# Altium schematic sheet currentdriver.SchDoc
size A4
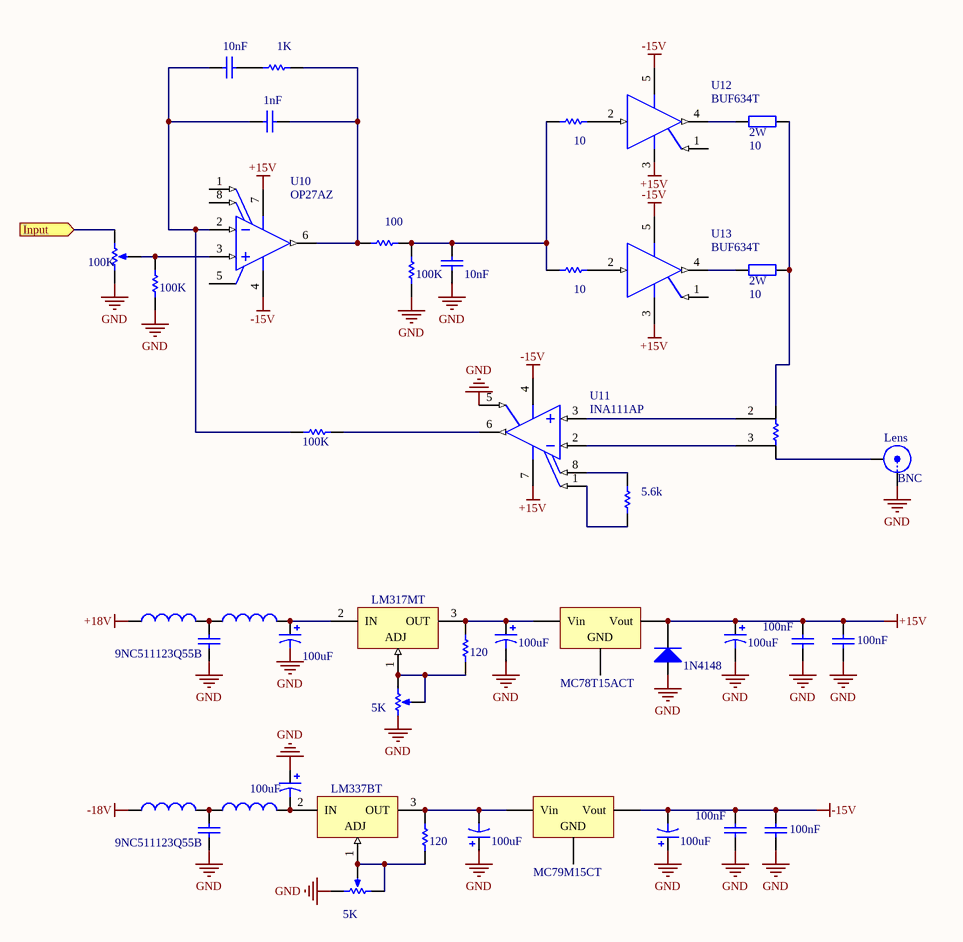
[diagram p0: currentdriver.SchDoc]

## Parts
(Parts that share a designator on the sheet are numbered #1, #2 ... from top to bottom, then left to right.)
C?#1  value 10nF  [RAD-0.3]  (hidden comment: Cap)
C?#2  value 1nF  [RAD-0.3]  (hidden comment: Cap)
C?#3  value 10nF  [RAD-0.3]  (hidden comment: Cap)
C?#4  value 100uF  [RB7.6-15]  (hidden comment: Cap Pol1)
C?#5  value 100uF  [RB7.6-15]  (hidden comment: Cap Pol1)
C?#6  value 100uF  [RB7.6-15]  (hidden comment: Cap Pol1)
C?#7  9NC511123Q55B  [RAD-0.3]
C?#8  value 100nF  [RAD-0.3]  (hidden comment: Cap)
C?#9  value 100nF  [RAD-0.3]  (hidden comment: Cap)
C?#10  value 100uF  [RB7.6-15]  (hidden comment: Cap Pol1)
C?#11  9NC511123Q55B  [RAD-0.3]
C?#12  value 100uF  [RB7.6-15]  (hidden comment: Cap Pol1)
C?#13  value 100uF  [RB7.6-15]  (hidden comment: Cap Pol1)
C?#14  value 100nF  [RAD-0.3]  (hidden comment: Cap)
C?#15  value 100nF  [RAD-0.3]  (hidden comment: Cap)
D?  1N4148  [DO-35]
L?#1  Inductor  [0402-A]  (value not drawn)
L?#2  Inductor  [0402-A]  (value not drawn)
L?#3  Inductor  [0402-A]  (value not drawn)
L?#4  Inductor  [0402-A]  (value not drawn)
Lens  BNC  [BNC_RA CON]
R?#1  value 1K  [AXIAL-0.3]  (hidden comment: Res1)
R?#2  value 10  [AXIAL-0.3]  (hidden comment: Res1)
R?#3  2W  value 10  [AXIAL-0.4]
R?#4  value 100  [AXIAL-0.3]  (hidden comment: Res1)
R?#5  value 10  [AXIAL-0.3]  (hidden comment: Res1)
R?#6  2W  value 10  [AXIAL-0.4]
R?#7  value 100K  [VR5]  (hidden comment: RPot)
R?#8  value 100K  [AXIAL-0.3]  (hidden comment: Res1)
R?#9  value 100K  [AXIAL-0.3]  (hidden comment: Res1)
R?#10  value 100K  [AXIAL-0.3]  (hidden comment: Res1)
R?#11  value 5.6k  [AXIAL-0.3]  (hidden comment: Res1)
R?#12  value 120  [AXIAL-0.3]  (hidden comment: Res1)
R?#13  value 5K  [VR5]  (hidden comment: RPot)
R?#14  value 120  [AXIAL-0.3]  (hidden comment: Res1)
R?#15  value 5K  [VR5]  (hidden comment: RPot)
R??  Res1  [AXIAL-0.3]  (value not drawn)
U10  OP27AZ  [ADI-Q-8]
U11  INA111AP  [TI-P8]
U12  BUF634T  [TI-P8]
U13  BUF634T  [TI-P8]
U?#1  LM317MT  [LP3]
U?#2  LM337BT  [LP3]
VR?#1  MC78T15ACT  [D2PAK_N]
VR?#2  MC79M15CT  [D2PAK_N]

## Ports
Input (in)

## Nets
+15V: C?#6.1 C?#8.2 C?#9.2 D?.2(K) U10.7(+V) U11.7(V+) U13.3(V-) VR?#1.3(Vout)
+18V: L?#1.1
-15V: C?#13.2 C?#14.2 C?#15.2 U10.4(-V) U11.4(V-) U12.5(V+) U13.5(V+) VR?#2.3(Vout)
-18V: L?#3.1
GND: C?#3.1 C?#5.2 C?#6.2 C?#7.1 C?#8.1 C?#9.1 C?#10.1 C?#11.1 C?#12.1 C?#13.1 C?#14.1 C?#15.1 Lens.1(X) R?#7.1(TOP) R?#8.1 R?#9.1 R?#15.2(BOT) U11.5(REF)
Input: R?#7.2(BOT) ; port Input
NetC?#1_1: C?#1.1 C?#2.1 R?#10.2 U10.2(-IN)
NetC?#1_2: C?#1.2 R?#1.1
NetC?#2_2: C?#2.2 R?#1.2 R?#4.1 U10.6(OUT)
NetC?#3_2: C?#3.2 R?#2.1 R?#4.2 R?#5.1 R?#8.2
NetC?#4_1: C?#4.1 L?#2.2 U?#1.2(IN)
NetC?#5_1: C?#5.1 R?#12.2 U?#1.3(OUT) VR?#1.1(Vin)
NetC?#7_2: C?#7.2 L?#1.2 L?#2.1
NetC?#10_2: C?#10.2 L?#4.2 U?#2.2(IN)
NetC?#11_2: C?#11.2 L?#3.2 L?#4.1
NetC?#12_2: C?#12.2 R?#14.2 U?#2.3(OUT) VR?#2.1(Vin)
NetLens_2: Lens.2(Y) R??.2
NetR?#2_2: R?#2.2 U12.2(VIN-)
NetR?#3_1: R?#3.1 U12.4(VO)
NetR?#3_2: R?#3.2 R?#6.2 R??.1
NetR?#5_2: R?#5.2 U13.2(VIN-)
NetR?#6_1: R?#6.1 U13.4(VO)
NetR?#7_3: R?#7.3(TAP) R?#9.2 U10.3(+IN)
NetR?#10_1: R?#10.1 U11.6(VO)
NetR?#11_1: R?#11.1 U11.1(RG)
NetR?#11_2: R?#11.2 U11.8(RG)
NetR?#12_1: R?#12.1 R?#13.2(BOT) R?#13.3(TAP) U?#1.1(ADJ)
NetR?#14_1: R?#14.1 R?#15.1(TOP) R?#15.3(TAP) U?#2.1(ADJ)

Not connected (* = marked no-connect by the designer): C?#4 2; D? 1(A); R?#13 1(TOP); R?? 3; U10 1(VOS_TRIM) 5(NC) 8(VOS_TRIM); U11 2(VIN-) 3(VIN+); U12 1(REF) 3(V-); U13 1(REF); VR?#1 2(GND); VR?#2 2(GND)

## Notes on the sheet
- Labels drawn without touching a wire or pin: +15V, GND

## Library data of the parts
C?#1-C?#3 C?#8 C?#9 C?#14 C?#15 = Cap: Capacitor; Published: 8-Jun-2000; LatestRevisionDate: 17-Jul-2002; LatestRevisionNote: Re-released for DXP Platform.; PackageReference: RAD-0.3; Publisher: Altium Limited; PackageDescription: Radial Cap, Thru-Hole; 2 Leads; 0.3 in Pin Spacing
C?#4-C?#6 C?#10 C?#12 C?#13 = Cap Pol1: Polarized Capacitor (Radial); Published: 8-Jun-2000; LatestRevisionDate: 17-Jul-2002; LatestRevisionNote: Re-released for DXP Platform.; PackageReference: RB7.6-15; Publisher: Altium Limited; PackageDescription: Polarized Capacitor (Radial); 2 Leads
C?#7 C?#11 = Cap: Capacitor; Value: 100pF; Published: 8-Jun-2000; LatestRevisionDate: 17-Jul-2002; LatestRevisionNote: Re-released for DXP Platform.; PackageReference: RAD-0.3; Publisher: Altium Limited; PackageDescription: Radial Cap, Thru-Hole; 2 Leads; 0.3 in Pin Spacing
D? = Diode 1N4148: High Conductance Fast Diode; Published: 8-Jun-2000; LatestRevisionDate: 17-Jul-2002; LatestRevisionNote: Re-released for DXP Platform.; DatasheetVersion: 1997; PackageReference: DO-35; Publisher: Altium Limited; PackageDescription: Diode, Axial; Body 3.8 x 1.9 mm (LxDia. max), Lead Dia. 0.53 mm (max); Code_JEDEC: DO-204-AH; ComponentLink1Description: Manufacturer Link; ComponentLink1URL: http://www.fairchildsemi.com/; ComponentLink2Description: Datasheet; ComponentLink2URL: http://www.fairchildsemi.com/ds/1N%2F1N4148.pdf
L?#1-L?#4 = Inductor: Code_IEC: 1005; Value: 10mH; Published: 8-Jun-2000; LatestRevisionDate: 29-May-2009; LatestRevisionNote: IPC-7351 Footprint Added.; PackageReference: 0402-A; Publisher: Altium Limited; PackageDescription: Chip Inductor; Code_JEITA: 0402
Lens = BNC: BNC Elbow Connector; LatestRevisionDate: 17-Jul-2002; LatestRevisionNote: Re-released for DXP Platform.; Publisher: Altium Limited
R?#1 R?#2 R?#4 R?#5 R?#8-R?#12 R?#14 = Res1: Resistor; Published: 8-Jun-2000; LatestRevisionDate: 17-Jul-2002; LatestRevisionNote: Re-released for DXP Platform.; PackageReference: AXIAL-0.3; Publisher: Altium Limited; PackageDescription: Axial Device, Thru-Hole; 2 Leads; 0.3 in Pin Spacing
R?#3 R?#6 = Res2: Resistor; Published: 8-Jun-2000; LatestRevisionDate: 17-Jul-2002; LatestRevisionNote: Re-released for DXP Platform.; PackageReference: AXIAL-0.4; Publisher: Altium Limited; PackageDescription: Axial Device, Thru-Hole; 2 Leads; 0.4 in Pin Spacing
R?#7 R?#13 R?#15 = RPot: Potentiometer; Sim Note: Enter the Resistance value and the set point into parameter fields.; Set Position: 0.5; Published: 8-Jun-2000; LatestRevisionDate: 17-Jul-2002; LatestRevisionNote: Re-released for DXP Platform.; PackageReference: VR5; Publisher: Altium Limited; PackageDescription: Variable Resistor, Thru-Hole; 3 Leads
R?? = Res1: Resistor; Value: 100K; Published: 8-Jun-2000; LatestRevisionDate: 17-Jul-2002; LatestRevisionNote: Re-released for DXP Platform.; PackageReference: AXIAL-0.3; Publisher: Altium Limited; PackageDescription: Axial Device, Thru-Hole; 2 Leads; 0.3 in Pin Spacing
U10 = OP27AZ: Single Channel Low Noise Operational Amplifier, 8 MHz BW, 2.8 V/us SR, Industrial, 8-pin DIP (Q-8), Tube; Generic Part Number: OP27; Manufacturer: Analog Devices; Amplifiers Per Package: 1; Input Bias Current: 15nA; Input Offset Voltage: 30uV; Iq/Amp: 5.7mA; Small Signal Bandwidth: 8MHz; V Span Max: 44V; V Span Min: 8V; DatasheetVersion: Rev. F; PackageReference: Q-8; PackageDescription: 8-Pin Ceramic Dual In-Line Package, Row spacing 7.62 mm, Pitch 2.54 mm; Supplier 1: Digi-Key; Supplier Part Number 1: OP27AZ-ND; Supplier 2: Farnell; Supplier Part Number 2: 5058806; Supplier 3: Newark; Supplier Part Number 3: 07C8653; Packing: Tube; Slew Rate: 2.8V/us; Mounting Technology: Through Hole; PartNumber: OP27AZ; ComponentLink1Description: Manufacturer URL; ComponentLink1URL: http://www.analog.com/en/index.html; ComponentLink2Description: Datasheet; ComponentLink2URL: http://www.analog.com/static/imported-files/data_sheets/OP27.pdf; ComponentLink3Description: Package Specification; ComponentLink3URL: http://www.analog.com/static/imported-files/packages/3925655241313314758Q_8.pdf
U11-U13 = INA111AP: High Speed FET-Input Instrumentation Amplifier, -40 to 85 degC, 8-pin DIP (P8), Green (RoHS & no Sb/Br); Manufacturer: Texas Instruments; CMRR(Min)(dB): 100; Gain(V/V): 1 to 10000; Input Bias Current (+/-)(Max)(nA): 0.02; Input Offset (+/-)(Max)(uV): 1000; Input Offset Drift (+/-)(Max)(uV/Degrees Celsius): 10; Non-Linearity (+/-)(Max)(%): 0.01; Number of Channels: 1; Quiescent Current (+/-)(Typ)(mA): 3.3; SubFamily: Dual Supply; Vs(Max)(V): 36; Vs(Min)(V): 12; DatasheetVersion: SBOS015; PackageVersion: 4040082/E, 04/2010; PackageReference: P8; PackageDescription: 8-Pin Plastic In-Line, Body 9.59 x 6.35 mm, Pitch 2.54 mm; Supplier 1: Digi-Key; Supplier Part Number 1: INA111AP-ND; Supplier 2: Newark; Supplier Part Number 2: 74K3808; Supplier 3: Mouser; Supplier Part Number 3: 595-INA111AP; Eco-Plan: Green (RoHS & no Sb/Br); Noise at 1kHz(Typ)(nV/rt(Hz)): 10; Mounting Technology: Through Hole; Code_JEDEC: MS-001; PartNumber: INA111AP; ComponentLink1Description: Manufacturer URL; ComponentLink1URL: http://www.ti.com/; ComponentLink2Description: Datasheet; ComponentLink2URL: http://www.ti.com/general/docs/lit/getliterature.tsp?genericPartNumber=INA111&fileType=pdf; ComponentLink3Description: Package Specification; ComponentLink3URL: http://www.ti.com/litv/pdf/mpdi001b
U?#1 U?#2 = LM317LILPRE3: Adjustable Regulator with 3.7 to 38 V Input and 1.2 to 32 V Output, -40 to 125 degC, 3-Pin TO-92 (LP), Pb-Free (RoHS); Manufacturer: Texas Instruments; Iout(Max)(A): 0.1; Vin(Max)(V): 38; Vin(Min)(V): 3.7; Vout(Max)(V): 32; Vout(Min)(V): 1.2; DatasheetVersion: SLCS144D; PackageVersion: revC, Oct-2001; PackageReference: LP3; PackageDescription: Plastic Cylindrical Package, Formed Lead Option (TO-92); Supplier 1: Digi-Key; Supplier Part Number 1: LM317LILPRE3-ND; Supplier 2: Mouser; Supplier Part Number 2: 595-LM317LILPRE3; Eco-Plan: Pb-Free (RoHS); Mounting Technology: Through Hole; Code_JEDEC: TO-226-AA; PartNumber: LM317LILPRE3; ComponentLink1Description: Datasheet; ComponentLink1URL: http://www.ti.com/general/docs/lit/getliterature.tsp?genericPartNumber=LM317L&fileType=pdf; ComponentLink2Description: Package Specification; ComponentLink2URL: http://www.ti.com/litv/pdf/msot002a; ComponentLink3Description: URL Link1; ComponentLink3URL: Samples URL:http://www.ti.com/product/lm317l#samples
VR?#1 VR?#2 = Volt Reg: Voltage Regulator; Published: 24-Mar-1999; LatestRevisionDate: 29-May-2009; LatestRevisionNote: IPC-7351 Footprint Added.; PackageReference: D2PAK; Publisher: Altium Limited; PackageDescription: 3-Pin Transistor Outline Package 2.54 mm Pitch, 15.1 mm Lead Span